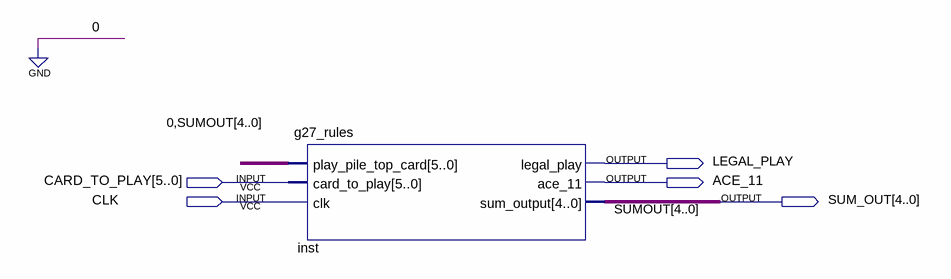
[diagram p0: schematic sheet]
// Quartus schematic g27_rules_schematic.bdf as structural Verilog: 1 symbols, 5 pins
module g27_rules_schematic (
  input  [5:0] CARD_TO_PLAY,
  input  CLK,
  output LEGAL_PLAY,
  output ACE_11,
  output [4:0] SUM_OUT
);

  g27_rules inst (
    .play_pile_top_card({1'b0, SUM_OUT}), .card_to_play(CARD_TO_PLAY), .clk(CLK), .legal_play(LEGAL_PLAY),
    .ace_11(ACE_11), .sum_output(SUM_OUT));

  // Other names for the same wires on the sheet: SUMOUT[4:0] = SUM_OUT
endmodule
